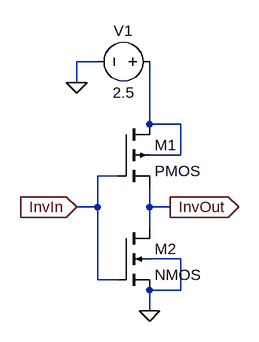
[diagram p0: schematic inv4x.asc]
inv4x.asc, the LTspice schematic file:
Version 4
SHEET 1 880 680
WIRE 96 -32 64 -32
WIRE 64 0 64 -32
WIRE 176 64 176 -32
WIRE 224 64 176 64
WIRE 224 112 224 64
WIRE 224 112 176 112
WIRE 128 144 96 144
WIRE 96 192 96 144
WIRE 96 192 64 192
WIRE 176 192 176 160
WIRE 208 192 176 192
WIRE 176 224 176 192
WIRE 224 272 176 272
WIRE 96 304 96 192
WIRE 128 304 96 304
WIRE 224 320 224 272
WIRE 224 320 176 320
WIRE 176 352 176 320
FLAG 176 352 0
FLAG 64 0 0
FLAG 64 192 InvIn
IOPIN 64 192 In
FLAG 208 192 InvOut
IOPIN 208 192 Out
SYMBOL pmos4 128 64 R0
SYMATTR InstName M1
SYMATTR Value2 l=2.4u w=11.52u
SYMBOL nmos4 128 224 R0
SYMATTR InstName M2
SYMATTR Value2 l=2.4u w=3.84u
SYMBOL voltage 192 -32 R90
WINDOW 0 -32 56 VBottom 2
WINDOW 3 32 56 VTop 2
WINDOW 123 0 0 Left 2
WINDOW 39 0 0 Left 2
SYMATTR InstName V1
SYMATTR Value 2.5

The netlist it stands for:
* inv4x.asc
M1 N001 InvIn InvOut N001 PMOS l=2.4u w=11.52u
M2 InvOut InvIn 0 0 NMOS l=2.4u w=3.84u
V1 N001 0 2.5
.model NMOS NMOS
.model PMOS PMOS
.lib standard.mos
.backanno
.end